# EAGLE design XMICRO-BREAKOUT-BREADBOARD (EAGLE 6.3)
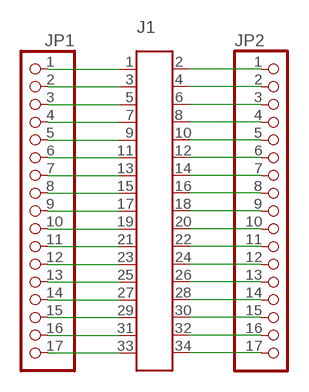
[diagram p0: schematic, sheet 1]

## Parts
J1  HDR-17X2  [HDR-17X2S]
JP1  PINHD-1X17  [1X17]
JP2  PINHD-1X17  [1X17]

## Nets
N$1: J1.1 JP1.1
N$2: J1.3 JP1.2
N$3: J1.5 JP1.3
N$4: J1.7 JP1.4
N$5: J1.9 JP1.5
N$6: J1.11 JP1.6
N$7: J1.13 JP1.7
N$8: J1.15 JP1.8
N$9: J1.17 JP1.9
N$10: J1.19 JP1.10
N$11: J1.21 JP1.11
N$12: J1.23 JP1.12
N$13: J1.25 JP1.13
N$14: J1.27 JP1.14
N$15: J1.29 JP1.15
N$16: J1.31 JP1.16
N$17: J1.33 JP1.17
N$18: J1.2 JP2.1
N$19: J1.4 JP2.2
N$20: J1.6 JP2.3
N$22: J1.8 JP2.4
N$23: J1.10 JP2.5
N$24: J1.12 JP2.6
N$25: J1.14 JP2.7
N$26: J1.16 JP2.8
N$27: J1.18 JP2.9
N$28: J1.20 JP2.10
N$29: J1.22 JP2.11
N$30: J1.24 JP2.12
N$31: J1.26 JP2.13
N$32: J1.28 JP2.14
N$33: J1.30 JP2.15
N$34: J1.32 JP2.16
N$35: J1.34 JP2.17

## Library data of the parts
J1 = Custom:HDR-17X2
JP1 JP2 = pinhead:PINHD-1X17: PIN HEADER

## Board
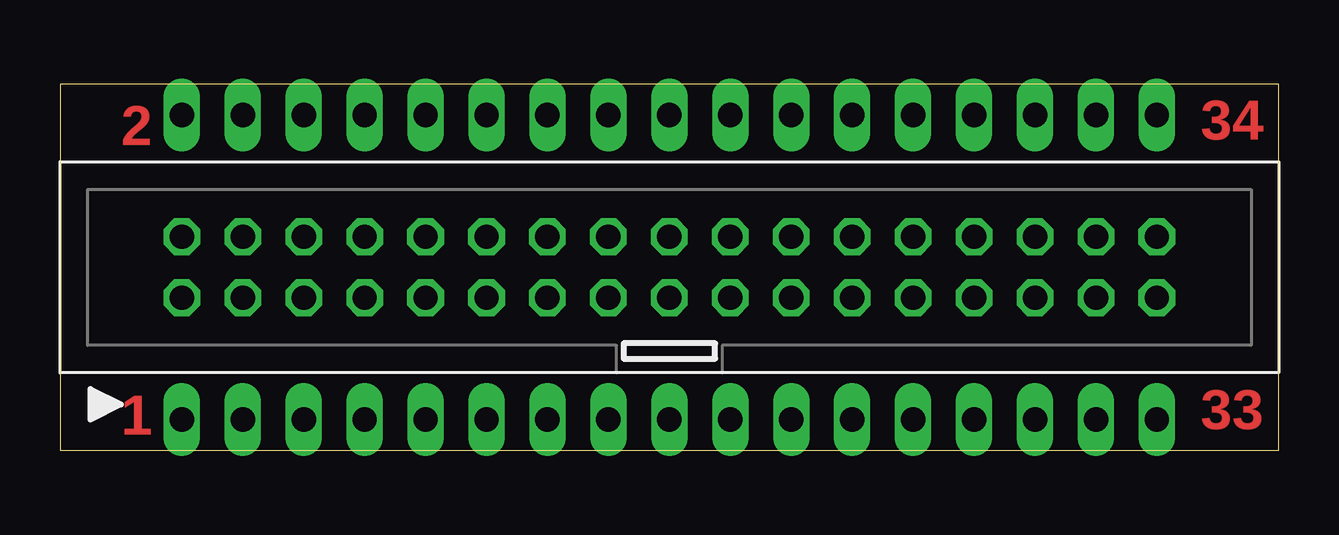
[diagram p1: board, top side]
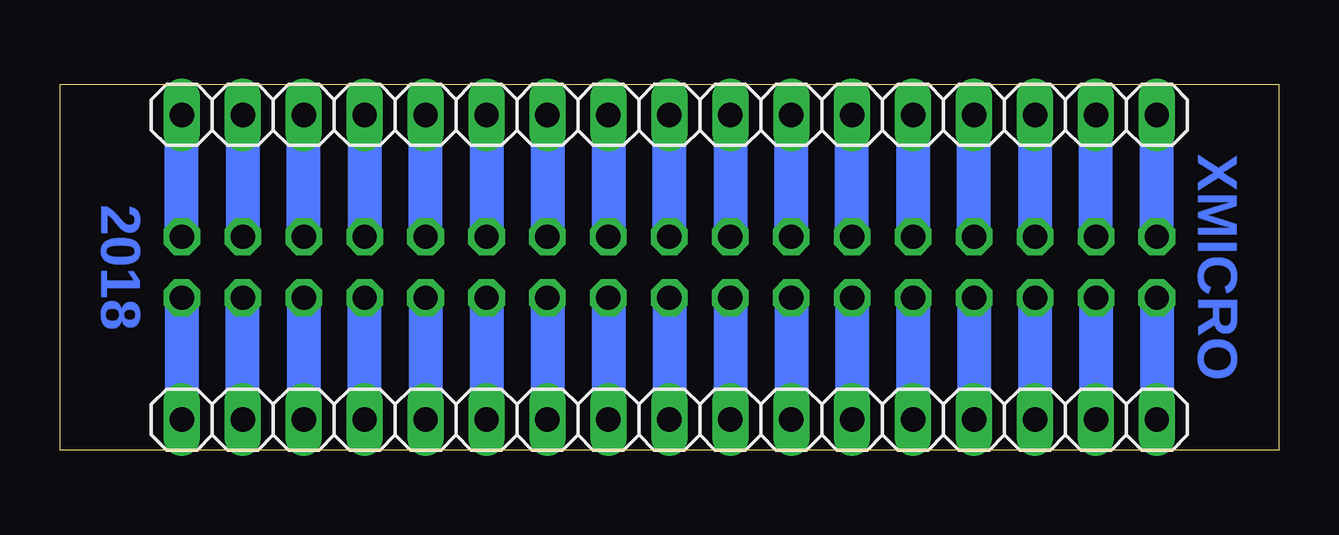
[diagram p2: board, bottom side, seen from below]

Size 50.8 x 15.24 mm. Coordinates in mm from the lower left corner, seen from the top.
Outline: 0,0 50.8,0 50.8,15.24 0,15.24 0,0
Copper layers (1*16): Top 0.035mm / dielectric 1.5mm / Bottom 0.035mm
Design rules "default *": minimum track width 10mil, minimum drill 0.3mm, track to track 14mil, track to pad 14mil, pad to pad 14mil, via to via 14mil, smd to smd 10mil, copper to edge 40mil, drill to drill 10mil, minimum pad ring 10mil, minimum via ring 8mil, stop-mask expansion 4mil, vias tented up to drill 0mil, thermal gap 10mil

### Footprints (pad centres in the part's own frame; a part is rotated, then mirrored left to right if it is on the bottom)
HDR-17X2S = drill 1.016 octagon: 1 -20.32,-1.27; 2 -20.32,1.27; 3 -17.78,-1.27; 4 -17.78,1.27; 5 -15.24,-1.27; 6 -15.24,1.27; 7 -12.7,-1.27; 8 -12.7,1.27; 9 -10.16,-1.27; 10 -10.16,1.27; 11 -7.62,-1.27; 12 -7.62,1.27; 13 -5.08,-1.27; 14 -5.08,1.27; 15 -2.54,-1.27; 16 -2.54,1.27; 17 0,-1.27; 18 0,1.27; 19 2.54,-1.27; 20 2.54,1.27; 21 5.08,-1.27; 22 5.08,1.27; 23 7.62,-1.27; 24 7.62,1.27; 25 10.16,-1.27; 26 10.16,1.27; 27 12.7,-1.27; 28 12.7,1.27; 29 15.24,-1.27; 30 15.24,1.27; 31 17.78,-1.27; 32 17.78,1.27; 33 20.32,-1.27; 34 20.32,1.27
1X17 = drill 1.016 long: 1 -20.32,0; 2 -17.78,0; 3 -15.24,0; 4 -12.7,0; 5 -10.16,0; 6 -7.62,0; 7 -5.08,0; 8 -2.54,0; 9 0,0; 10 2.54,0; 11 5.08,0; 12 7.62,0; 13 10.16,0; 14 12.7,0; 15 15.24,0; 16 17.78,0; 17 20.32,0

### Placement (x,y rotation side)
J1  25.4,7.62 0 top
JP1  25.4,1.27 180 bottom
JP2  25.4,13.97 180 bottom

### Tracks (layer width: path | path; a pad name or v marks a point on that pad's centre or on a via)
N$1
  Bottom 1.422: J1.1 JP1.1
N$2
  Bottom 1.422: J1.3 JP1.2
N$3
  Bottom 1.422: J1.5 JP1.3
N$4
  Bottom 1.422: J1.7 JP1.4
N$5
  Bottom 1.422: J1.9 JP1.5
N$6
  Bottom 1.422: J1.11 JP1.6
N$7
  Bottom 1.422: J1.13 JP1.7
N$8
  Bottom 1.422: J1.15 JP1.8
N$9
  Bottom 1.422: J1.17 JP1.9
N$10
  Bottom 1.422: J1.19 JP1.10
N$11
  Bottom 1.422: J1.21 JP1.11
N$12
  Bottom 1.422: J1.23 JP1.12
N$13
  Bottom 1.422: J1.25 JP1.13
N$14
  Bottom 1.422: JP1.14 J1.27
N$15
  Bottom 1.422: J1.29 JP1.15
N$16
  Bottom 1.422: JP1.16 J1.31
N$17
  Bottom 1.422: J1.33 JP1.17
N$18
  Bottom 1.422: J1.2 JP2.1
N$19
  Bottom 1.422: J1.4 JP2.2
N$20
  Bottom 1.422: JP2.3 J1.6
N$22
  Bottom 1.422: J1.8 JP2.4
N$23
  Bottom 1.422: JP2.5 J1.10
N$24
  Bottom 1.422: J1.12 JP2.6
N$25
  Bottom 1.422: J1.14 JP2.7
N$26
  Bottom 1.422: JP2.8 J1.16
N$27
  Bottom 1.422: J1.18 JP2.9
N$28
  Bottom 1.422: JP2.10 J1.20
N$29
  Bottom 1.422: JP2.11 J1.22
N$30
  Bottom 1.422: JP2.12 J1.24
N$31
  Bottom 1.422: J1.26 JP2.13
N$32
  Bottom 1.422: JP2.14 J1.28
N$33
  Bottom 1.422: J1.30 JP2.15
N$34
  Bottom 1.422: JP2.16 J1.32
N$35
  Bottom 1.422: J1.34 JP2.17

### Text on the board
Top: 34 | 2 | 33 | 1
Bottom: XMICRO | 2018